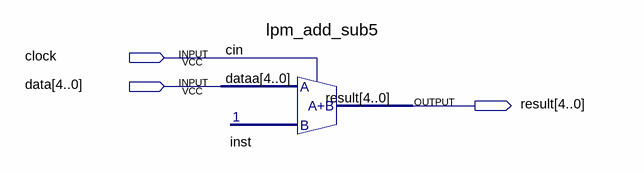
[diagram p0: schematic sheet]
// Quartus schematic Program Counter.bdf as structural Verilog: 1 symbols, 3 pins
module \Program_Counter  (
  input  clock,
  input  [4:0] data,
  output [4:0] result
);

  lpm_add_sub5 inst (.dataa(data), .cin(clock), .result(result));
endmodule
